# EAGLE design CrabTimerUSB_PWR (EAGLE 7.6.0)
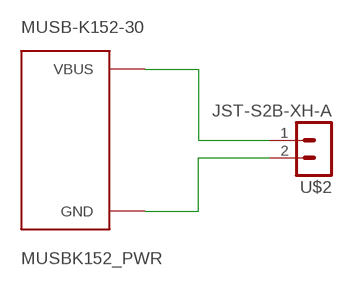
[diagram p0: schematic, sheet 1]

## Parts
U$1  MUSBK152_PWR  [MUSBK152_PWR]
U$2  JST-S2B-XH-A  [S2B-XH-A]

## Nets
N$1: U$1.VBUS U$2.1
N$2: U$1.GND U$2.2

## Library data of the parts
U$1 = mylibrary:MUSBK152_PWR
U$2 = mylibrary:JST-S2B-XH-A: JST Connector (2.5 mm / 0.1 in) - 2 Circuit / Side Entry

## Board
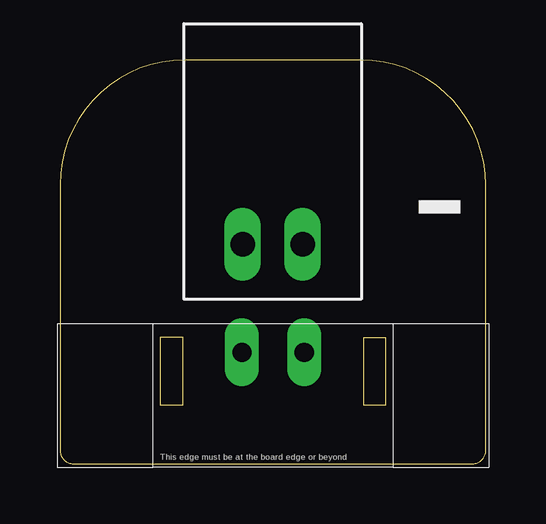
[diagram p1: board, top side]
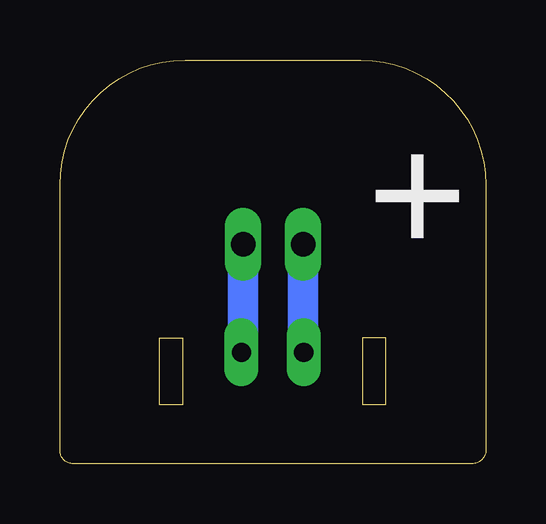
[diagram p2: board, bottom side, seen from below]

Size 17.76 x 16.84 mm. Coordinates in mm from the lower left corner, seen from the top.
Outline: 0,11.63 0,0.57 arc90 0.57,0 17.21,0 arc90 17.76,0.55 17.76,11.63 arc90 12.55,16.84 5.21,16.84 arc90 0,11.63
Copper layers (1*16): Top 0.0356mm / dielectric 1.5011mm / Bottom 0.0356mm
Design rules "oshpark-2layer": minimum track width 6mil, minimum drill 13mil, track to track 6mil, track to pad 6mil, pad to pad 6mil, via to via 6mil, smd to smd 6mil, copper to edge 15mil, drill to drill 6mil, minimum pad ring 7mil, minimum via ring 7mil, stop-mask expansion 2.5mil, vias tented up to drill 0mil, thermal gap 10mil

### Footprints (pad centres in the part's own frame; a part is rotated, then mirrored left to right if it is on the bottom)
MUSBK152_PWR = drill 0.8 pad 1.422 long: GND 1.3,1.6; VBUS -1.3,1.6
S2B-XH-A = drill 1.016 long: 1 0.9,-1.65; 2 0.9,-4.15

### Placement (x,y rotation side)
U$1  8.89,3.05 0 top
U$2  5.97,8.26 90 top

### Tracks (layer width: path | path; a pad name or v marks a point on that pad's centre or on a via)
N$1
  Bottom 0.406: 7.62,4.68 U$1.VBUS
  Bottom 1.27: U$2.1 7.62,4.68
N$2
  Bottom 0.406: 10.12,4.72 U$1.GND
  Bottom 1.27: U$2.2 10.12,4.72

### Text on the board
tPlace: -
bPlace: +